# Altium schematic sheet Sheet_2.schdoc
size 441 x 247 mm
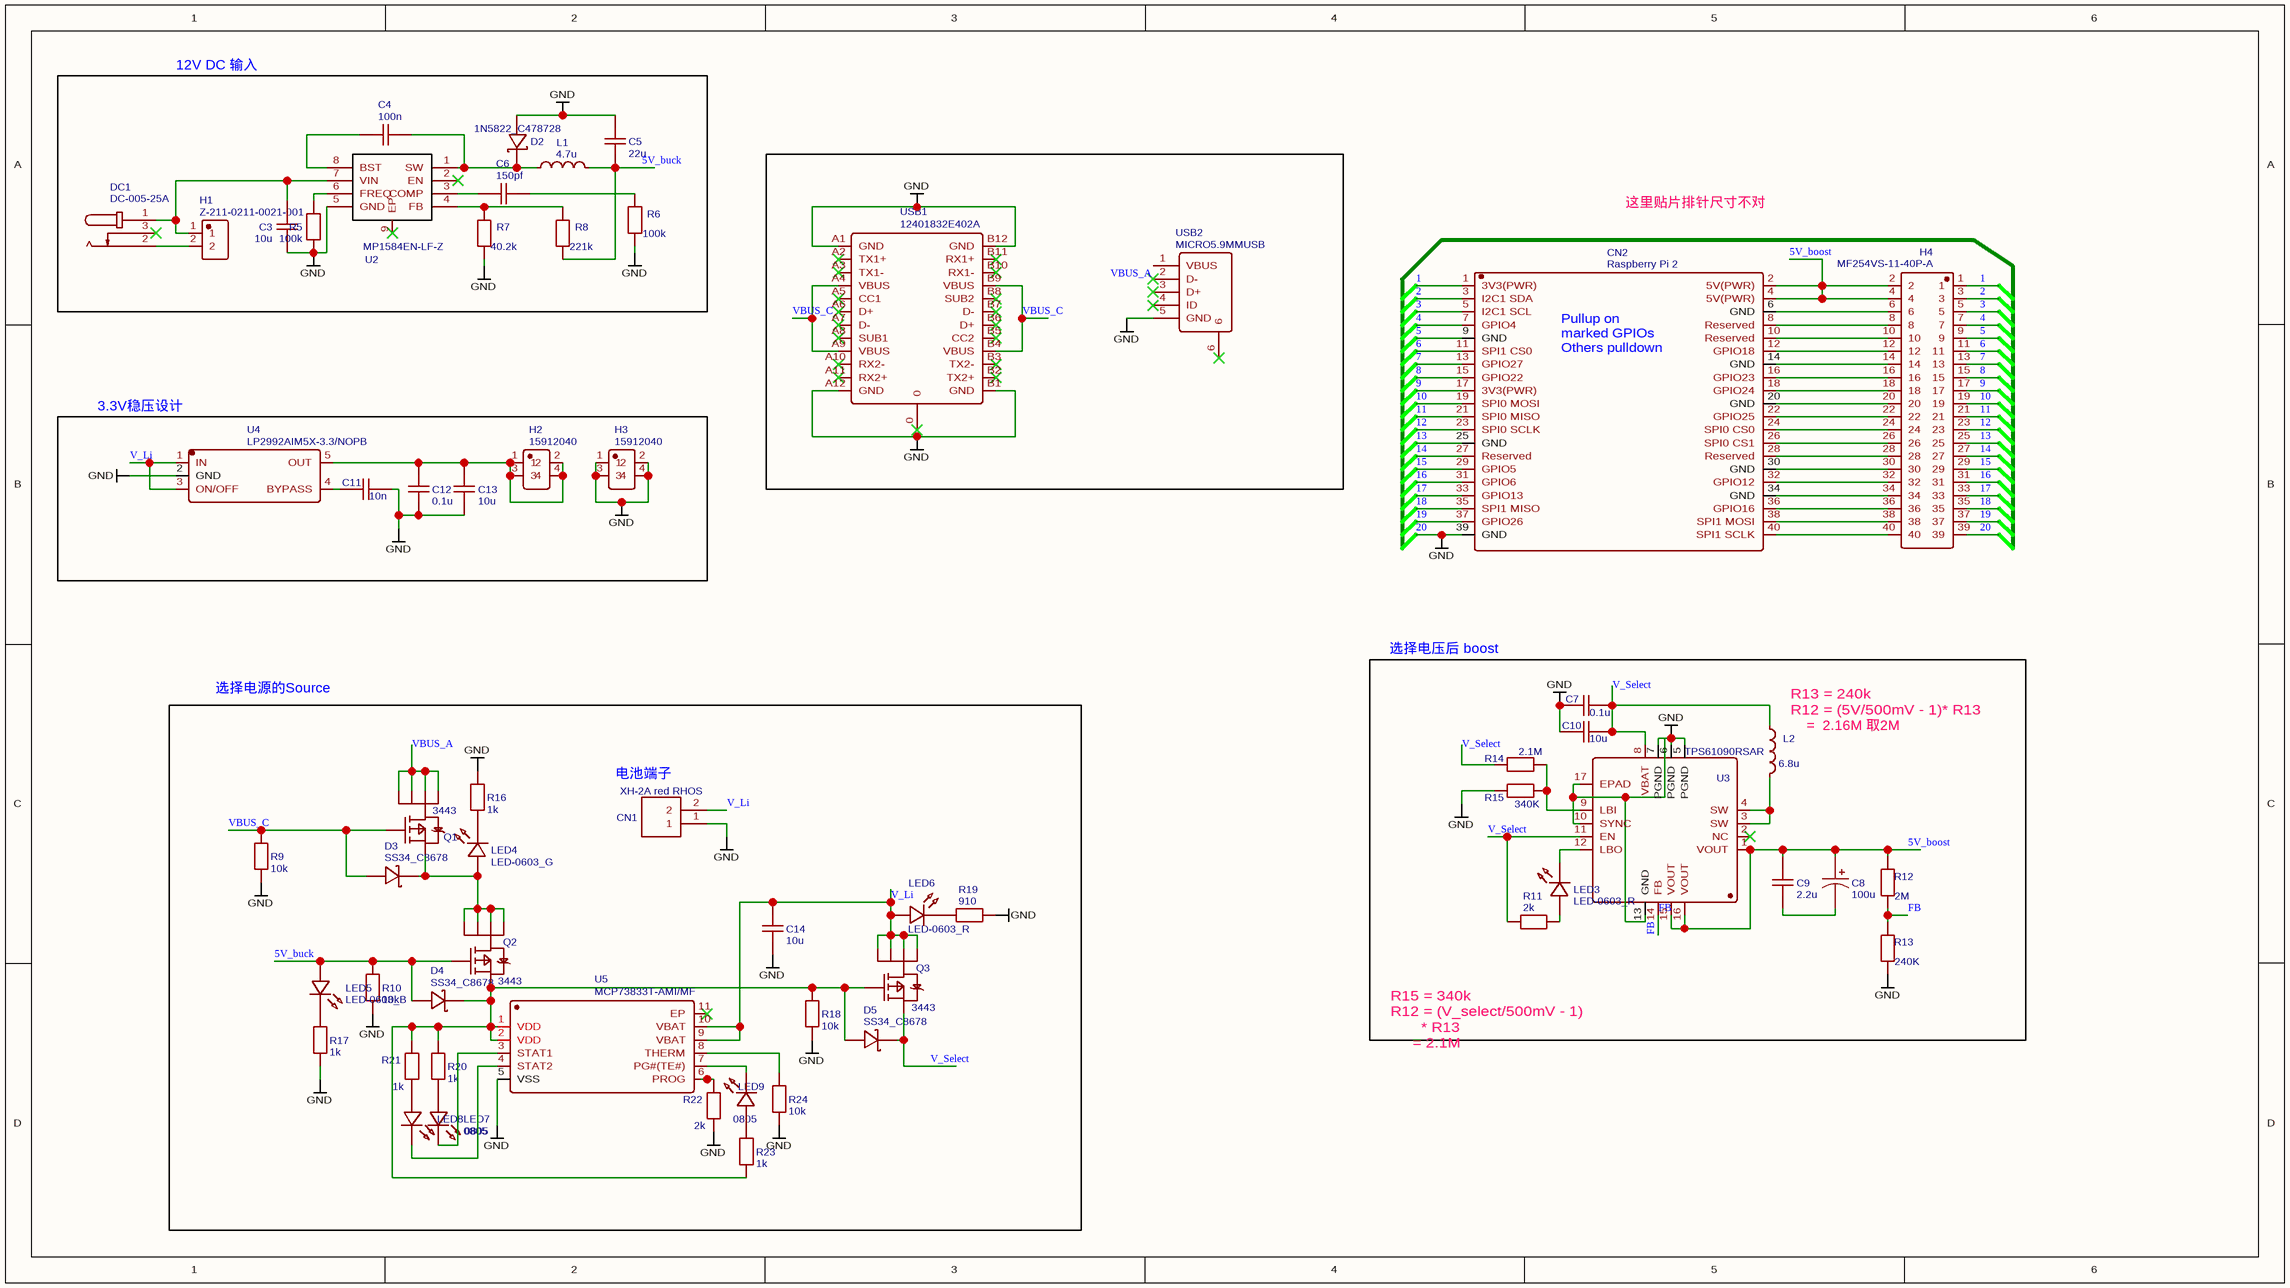
[diagram p0: Sheet_2.schdoc]

## Parts
C3  10u  [C0603]
C4  100n  [C0603]
C5  22u  [C0603]
C6  150pf  [C0603]
C7  0.1u  [C0603]
C8  100u  [CASE-A_3216]
C9  2.2u  [C0603]
C10  10u  [C0603]
C11  10n  [C0603]
C12  0.1u  [C0603]
C13  10u  [C0603]
C14  10u  [C0603]
CN1  XH-2A red RHOS  [CONN-TH_2P-P2.50_XH-2A]
CN2  Raspberry Pi 2  [HDR2X20-REVERSED]
D2  1N5822_C478728  [DO-201AD_BD5.3-L8.4-P12.50-D1.4-RD]
D3  SS34_C8678  [DO-214AC_L4.3-W2.7-LS5.3-RD]
D4  SS34_C8678  [DO-214AC_L4.3-W2.7-LS5.3-RD]
D5  SS34_C8678  [DO-214AC_L4.3-W2.7-LS5.3-RD]
DC1  DC-005-25A  [DC-IN-TH_DC005]
H1  Z-211-0211-0021-001  [HDR-TH_2P-P2.54-V]
H2  15912040  [HDR-SMD_4P-P2.54-V-M-R2-C2-S2.54_15912040]
H3  15912040  [HDR-SMD_4P-P2.54-V-M-R2-C2-S2.54_15912040]
H4  MF254VS-11-40P-A  [HDR-SMD_40P-P2.54-V-F-R2-C40-S4.7]
L1  4.7u  [L0603]
L2  6.8u  [L0603]
LED3  LED-0603_R  [LED0603_RED]
LED4  LED-0603_G  [LED0603_GREEN]
LED5  LED-0603_B  [LED0603_BLUE]
LED6  LED-0603_R  [LED0603_RED]
LED7  0805  [LED0805_RED]
LED8  0805  [LED0805_GREEN]
LED9  0805  [LED0805_BLUE]
Q1  3443  [SOT-23-6_L2.9-W1.6-P0.95-LS2.8-BL]
Q2  3443  [SOT-23-6_L2.9-W1.6-P0.95-LS2.8-BL]
Q3  3443  [SOT-23-6_L2.9-W1.6-P0.95-LS2.8-BL]
R5  100k  [R0603]
R6  100k  [R0603]
R7  40.2k  [R0603]
R8  221k  [R0603]
R9  10k  [R0603]
R10  10k  [R0603]
R11  2k  [R0603]
R12  2M  [R0603]
R13  240K  [R0603]
R14  2.1M  [R0603]
R15  340K  [R0603]
R16  1k  [R0603]
R17  1k  [R0603]
R18  10k  [R0603]
R19  910  [R0603]
R20  1k  [R0603]
R21  1k  [R0603]
R22  2k  [R0603]
R23  1k  [R0603]
R24  10k  [R0603]
U2  MP1584EN-LF-Z  [SOIC-8_L5.0-W4.0-P1.27-LS6.0-BL-EP]
U3  TPS61090RSAR  [QFN-16_L4.0-W4.0-P0.65-TL-EP2.7]
U4  LP2992AIM5X-3.3/NOPB  [SOT-23-5_L3.0-W1.7-P0.95-LS2.8-BR]
U5  MCP73833T-AMI/MF  [DFN-10_L3.0-W3.0-P0.50-BL-EP]
USB1  12401832E402A  [USB-C-TH_12401832E402A]
USB2  MICRO5.9MMUSB  [MICRO-USB-SMD_5P-P0.65-H-F_MICRO5.9MMUSB]

## Blocks framed on the sheet
12V DC 输入: C3-C6 D2 DC1 H1 L1 R5-R8 U2
3.3V稳压设计: C11-C13 H2 H3 U4
选择电压后 boost: C7-C10 L2 LED3 R11-R15 U3

## Nets
20: C3.1 C5.1 C7.2 C10.2 C11.1 C12.2 C13.2 C14.1 CN1.1 CN2.39(GND) D2.2(A) H3.1 H3.2 H3.3 H3.4 H4.39 R5.2 R6.2 R7.2 R9.1 R10.1 R13.2 R15.2 R16.2 R17.1 R18.1 R19.1 R22.1 R24.1 U2.5(GND) U3.5(PGND) U3.6(PGND) U3.7(PGND) U3.10(SYNC) U3.13(GND) U3.17(EPAD) U4.2(GND) U5.5(VSS) USB1.A1(GND) USB1.A12(GND) USB1.B1(GND) USB1.B12(GND) USB2.5(GND)  [also labelled GND]
1: CN2.1(3V3(PWR)) H4.1
2: CN2.3(I2C1_SDA) H4.3
3: CN2.5(I2C1_SCL) H4.5
4: CN2.7(GPIO4) H4.7
5: CN2.9(GND) H4.9
5V_boost: C8.1 C9.2 CN2.2(5V(PWR)) CN2.4(5V(PWR)) H4.2 H4.4 R12.1 U3.1(VOUT) U3.15(VOUT) U3.16(VOUT)
5V_buck: C5.2 D4.2(A) L1.2 LED5.1 Q2.3(G) R8.2 R10.2
6: CN2.11(SPI1_CS0) H4.11
7: CN2.13(GPIO27) H4.13
8: CN2.15(GPIO22) H4.15
9: CN2.17(3V3(PWR)) H4.17
10: CN2.19(SPI0_MOSI) H4.19
11: CN2.21(SPI0_MISO) H4.21
12: CN2.23(SPI0_SCLK) H4.23
13: CN2.25(GND) H4.25
14: CN2.27(Reserved) H4.27
15: CN2.29(GPIO5) H4.29
16: CN2.31(GPIO6) H4.31
17: CN2.33(GPIO13) H4.33
18: CN2.35(SPI1_MISO) H4.35
19: CN2.37(GPIO26) H4.37
FB: R12.2 R13.1 U3.14(FB)
V_Li: C14.2 CN1.2 LED6.1 Q3.1(D) Q3.2(D) Q3.5(D) Q3.6(D) U4.1(IN) U4.3(ON/OFF) U5.9(VBAT) U5.10(VBAT)
V_Select: C7.1 C10.1 D5.1(K) L2.1 Q3.4(S) R11.2 R14.2 U3.8(VBAT) U3.11(EN)
VBUS_A: Q1.1(D) Q1.2(D) Q1.5(D) Q1.6(D) USB2.1(VBUS)
VBUS_C: D3.2(A) Q1.3(G) R9.2 USB1.A4(VBUS) USB1.A9(VBUS) USB1.B4(VBUS) USB1.B9(VBUS)
NetC3_2: C3.2 DC1.1 H1.1 U2.7(VIN)
NetC4_1: C4.1 D2.1(K) L1.1 U2.1(SW)
NetC4_2: C4.2 U2.8(BST)
NetC6_1: C6.1 U2.3(COMP)
NetC6_2: C6.2 R6.1
NetC8_2: C8.2 C9.1
NetC11_2: C11.2 U4.4(BYPASS)
NetC12_1: C12.1 C13.1 H2.1 H2.2 H2.3 H2.4 U4.5(OUT)
NetCN2_6: CN2.6(GND) H4.6
NetCN2_8: CN2.8(Reserved) H4.8
NetCN2_10: CN2.10(Reserved) H4.10
NetCN2_12: CN2.12(GPIO18) H4.12
NetCN2_14: CN2.14(GND) H4.14
NetCN2_16: CN2.16(GPIO23) H4.16
NetCN2_18: CN2.18(GPIO24) H4.18
NetCN2_20: CN2.20(GND) H4.20
NetCN2_22: CN2.22(GPIO25) H4.22
NetCN2_24: CN2.24(SPI0_CS0) H4.24
NetCN2_26: CN2.26(SPI0_CS1) H4.26
NetCN2_28: CN2.28(Reserved) H4.28
NetCN2_30: CN2.30(GND) H4.30
NetCN2_32: CN2.32(GPIO12) H4.32
NetCN2_34: CN2.34(GND) H4.34
NetCN2_36: CN2.36(GPIO16) H4.36
NetCN2_38: CN2.38(SPI1_MOSI) H4.38
NetCN2_40: CN2.40(SPI1_SCLK) H4.40
NetD3_1: D3.1(K) LED4.1 Q1.4(S) Q2.1(D) Q2.2(D) Q2.5(D) Q2.6(D)
NetD4_1: D4.1(K) D5.2(A) Q2.4(S) Q3.3(G) R18.2 R20.2 R21.2 R23.1 U5.1(VDD) U5.2(VDD)
NetDC1_2: DC1.2 H1.2
NetL2_2: L2.2 U3.3(SW) U3.4(SW)
NetLED3_1: LED3.1 R11.1
NetLED3_2: LED3.2 U3.12(LBO)
NetLED4_2: LED4.2 R16.1
NetLED5_2: LED5.2 R17.2
NetLED6_2: LED6.2 R19.2
NetLED7_1: LED7.1 R20.1
NetLED7_2: LED7.2 U5.3(STAT1)
NetLED8_1: LED8.1 R21.1
NetLED8_2: LED8.2 U5.4(STAT2)
NetLED9_1: LED9.1 R23.2
NetLED9_2: LED9.2 U5.7(PG#(TE#))
NetR5_1: R5.1 U2.6(FREQ)
NetR7_1: R7.1 R8.1 U2.4(FB)
NetR14_1: R14.1 R15.1 U3.9(LBI)
NetR22_2: R22.2 U5.6(PROG)
NetR24_2: R24.2 U5.8(THERM)

Not connected (* = marked no-connect by the designer): DC1 3*; U2 2(EN)* 9(EP)*; U3 2(NC)*; U5 11(EP)*; USB1 0* A2(TX1+)* A3(TX1-)* A5(CC1)* A6(D+)* A7(D-)* A8(SUB1)* A10(RX2-)* A11(RX2+)* B2(TX2+)* B3(TX2-)* B5(CC2)* B6(D+)* B7(D-)* B8(SUB2)* B10(RX1-)* B11(RX1+)*; USB2 2(D-)* 3(D+)* 4(ID)* 6*

## Notes on the sheet
- 这里贴片排针尺寸不对
- 选择电源的Source
- (near L2) R13 = 240k
  R12 = (5V/500mV - 1)* R13
  =  2.16M 取2M
- (near CN1) 电池端子
- R15 = 340k
  R12 = (V_select/500mV - 1)
  * R13
  = 2.1M
- (in symbol Raspberry Pi 2) Pullup on / marked GPIOs / Others pulldown

## Library data of the parts
C3 C10 C13 C14 = 10u: nameAlias: Value(F); Contributor: LCEDA_Lib; spicePre: C; spiceSymbolName: C_0603_US
C4 = 100n: nameAlias: Value(F); Contributor: LCEDA_Lib; spicePre: C; spiceSymbolName: C_0603_US
C5 = 22u: nameAlias: Value(F); Contributor: LCEDA_Lib; spicePre: C; spiceSymbolName: C_0603_US
C6 = 150pf: nameAlias: Value(F); Contributor: LCEDA_Lib; spicePre: C; spiceSymbolName: C_0603_US
C7 C12 = 0.1u: nameAlias: Value(F); Contributor: LCEDA_Lib; spicePre: C; spiceSymbolName: C_0603_US
C8 = 100u: nameAlias: Value(F); Contributor: LCEDA_Lib; spicePre: C; spiceSymbolName: C_Tan_SMD_A_US
C9 = 2.2u: nameAlias: Value(F); Contributor: LCEDA_Lib; spicePre: C; spiceSymbolName: C_0603_US
C11 = 10n: nameAlias: Value(F); Contributor: LCEDA_Lib; spicePre: C; spiceSymbolName: C_0603_US
CN1 = XH-2A red RHOS: BOM_Manufacturer: BOOMELE; BOM_Supplier: LCSC; BOM_Manufacturer Part: XH-2A red RHOS; image: //image.lceda.cn/szlcsc/C24192.jpg; BOM_Supplier Part: C24192; spicePre: C; spiceSymbolName: XH-2A red RHOS
CN2 = Raspberry Pi 2: Contributor: Jason+Pierce; sourceId: gQK2WevN5; spicePre: C; spiceSymbolName: Raspberry Pi 2
D2 = 1N5822_C478728: BOM_Manufacturer: JH; BOM_Manufacturer Part: 1N5822; Contributor: LCSC; BOM_Supplier: LCSC; BOM_Supplier Part: C478728; spicePre: D; spiceSymbolName: 1N5822_C478728
D3-D5 = SS34_C8678: BOM_Manufacturer Part: SS34; BOM_Manufacturer: MDD; SMT Type: Basic; BOM_Supplier: LCSC; image: //image.lceda.cn/szlcsc/C8678.jpg; BOM_Supplier Part: C8678; BOM_LCSC Assembly: Yes; spicePre: D; spiceSymbolName: SS34_C8678
DC1 = DC-005-25A: BOM_Manufacturer: HRO; Contributor: LCSC; BOM_Supplier: LCSC; BOM_Manufacturer Part: DC-005-25A; BOM_Supplier Part: C136715; spicePre: D; spiceSymbolName: DC-005-25A
H1 = Z-211-0211-0021-001: BOM_Manufacturer: ZHENGLING; Contributor: LCSC; BOM_Supplier: LCSC; BOM_Manufacturer Part: Z-211-0211-0021-001; BOM_Supplier Part: C152154; spicePre: H; spiceSymbolName: Z-211-0211-0021-001
H2 H3 = 15912040: BOM_Manufacturer: MOLEX; Contributor: LCSC; BOM_Supplier: LCSC; BOM_Supplier Part: C586564; BOM_Manufacturer Part: 15912040; spicePre: H; spiceSymbolName: 15912040
H4 = MF254VS-11-40P-A: BOM_Manufacturer: XFCN; Contributor: LCSC; BOM_Supplier: LCSC; BOM_Supplier Part: C492236; BOM_Manufacturer Part: MF254VS-11-40P-A; spicePre: H; spiceSymbolName: MF254VS-11-40P-A
L1 = 4.7u: nameAlias: Value(H); Contributor: LCEDA_Lib; spicePre: L; spiceSymbolName: L0603_US
L2 = 6.8u: nameAlias: Value(H); Contributor: LCEDA_Lib; spicePre: L; spiceSymbolName: L0603_US
LED3 LED6 = LED-0603_R: BOM_Manufacturer: EVERLIGHT(台湾亿光); BOM_Manufacturer Part: 19-217/R6C-AL1M2VY/3T; Contributor: LCEDA_01; BOM_Supplier Part: C72044; BOM_Supplier: LCSC; spicePre: L; spiceSymbolName: LED-0603_R
LED4 = LED-0603_G: BOM_Manufacturer: EVERLIGHT(台湾亿光); BOM_Manufacturer Part: 19-217/GHC-YR1S2/3T; Contributor: LCEDA_Lib; BOM_Supplier Part: C72043; BOM_Supplier: LCSC; spicePre: L; spiceSymbolName: LED-0603_G
LED5 = LED-0603_B: BOM_Manufacturer: EVERLIGHT(台湾亿光); BOM_Manufacturer Part: 19-217/BHC-ZL1M2RY/3T; Contributor: LCEDA_01; BOM_Supplier Part: C72041; BOM_Supplier: LCSC; spicePre: L; spiceSymbolName: LED-0603_B
LED7 = 0805: BOM_Manufacturer: EVERLIGHT(台湾亿光); BOM_Manufacturer Part: 17-21SURC/S530-A3/TR8; Contributor: LCEDA_Lib; BOM_Supplier Part: C72037; spicePre: L; spiceSymbolName: LED-0805_R
LED8 = 0805: BOM_Manufacturer: 国星光电; BOM_Manufacturer Part: NCD0805G1; Contributor: LCEDA_Lib; BOM_Supplier Part: C84260; spicePre: L; spiceSymbolName: LED-0805_G
LED9 = 0805: BOM_Manufacturer: 方舟 ARKLED; BOM_Manufacturer Part: D-B080508B1-KS2; Contributor: LCEDA_Lib; BOM_Supplier Part: C108412; spicePre: L; spiceSymbolName: LED-0805_B
Q1-Q3 = 3443: BOM_Manufacturer: VBsemi Elec; BOM_Manufacturer Part: NTGS3443T1G; Contributor: LCSC; BOM_Supplier: LCSC; BOM_Supplier Part: C558216; spicePre: Q; spiceSymbolName: NTGS3443T1G_C558216
R5 R6 = 100k: nameAlias: Value(Ω); Contributor: LCEDA_Lib; spicePre: R; spiceSymbolName: R_0603_EU
R7 = 40.2k: nameAlias: Value(Ω); Contributor: LCEDA_Lib; spicePre: R; spiceSymbolName: R_0603_EU
R8 = 221k: nameAlias: Value(Ω); Contributor: LCEDA_Lib; spicePre: R; spiceSymbolName: R_0603_EU
R9 R10 R18 R24 = 10k: nameAlias: Value(Ω); Contributor: LCEDA_Lib; spicePre: R; spiceSymbolName: R_0603_EU
R11 R22 = 2k: nameAlias: Value(Ω); Contributor: LCEDA_Lib; spicePre: R; spiceSymbolName: R_0603_EU
R12 = 2M: nameAlias: Value(Ω); Contributor: LCEDA_Lib; spicePre: R; spiceSymbolName: R_0603_EU
R13 = 240K: nameAlias: Value(Ω); Contributor: LCEDA_Lib; spicePre: R; spiceSymbolName: R_0603_EU
R14 = 2.1M: nameAlias: Value(Ω); Contributor: LCEDA_Lib; spicePre: R; spiceSymbolName: R_0603_EU
R15 = 340K: nameAlias: Value(Ω); Contributor: LCEDA_Lib; spicePre: R; spiceSymbolName: R_0603_EU
R16 R17 R20 R21 R23 = 1k: nameAlias: Value(Ω); Contributor: LCEDA_Lib; spicePre: R; spiceSymbolName: R_0603_EU
R19 = 910: nameAlias: Value(Ω); Contributor: LCEDA_Lib; spicePre: R; spiceSymbolName: R_0603_EU
U2 = MP1584EN-LF-Z: BOM_Manufacturer: MPS; SMT Type: Basic; BOM_Supplier: LCSC; BOM_Manufacturer Part: MP1584EN-LF-Z; BOM_LCSC Assembly: Yes; image: //image.lceda.cn/szlcsc/C15051.jpg; BOM_Supplier Part: C15051; spicePre: U; spiceSymbolName: MP1584EN-LF-Z
U3 = TPS61090RSAR: BOM_Manufacturer: Texas Instruments; Contributor: LCSC; SMT Type: Extend; BOM_Supplier: LCSC; BOM_Supplier Part: C206167; BOM_Manufacturer Part: TPS61090RSAR; BOM_LCSC Assembly: Yes; spicePre: U; spiceSymbolName: TPS61090RSAR
U4 = LP2992AIM5X-3.3/NOPB: BOM_Manufacturer: Texas Instruments; Contributor: LCSC; SMT Type: Extend; BOM_Supplier: LCSC; BOM_Supplier Part: C111076; BOM_Manufacturer Part: LP2992AIM5X-3.3/NOPB; BOM_LCSC Assembly: Yes; spicePre: U; spiceSymbolName: LP2992AIM5X-3.3/NOPB
U5 = MCP73833T-AMI/MF: BOM_Manufacturer: Microchip Tech; Contributor: LCSC; SMT Type: Extend; BOM_Supplier: LCSC; BOM_Supplier Part: C340160; BOM_Manufacturer Part: MCP73833T-AMI/MF; BOM_LCSC Assembly: Yes; spicePre: U; spiceSymbolName: MCP73833T-AMI/MF
USB1 = 12401832E402A: BOM_Manufacturer: Amphenol ICC; Contributor: LCSC; BOM_Supplier: LCSC; BOM_Supplier Part: C464604; BOM_Manufacturer Part: 12401832E402A; spicePre: U; spiceSymbolName: 12401832E402A
USB2 = MICRO5.9MMUSB: BOM_Manufacturer: SHOU HAN; Contributor: LCSC; BOM_Supplier: LCSC; BOM_Supplier Part: C393940; BOM_Manufacturer Part: MICRO5.9mmusb; spicePre: U; spiceSymbolName: MICRO5.9MMUSB